# EAGLE design out8_16A_mi (EAGLE 5.04)
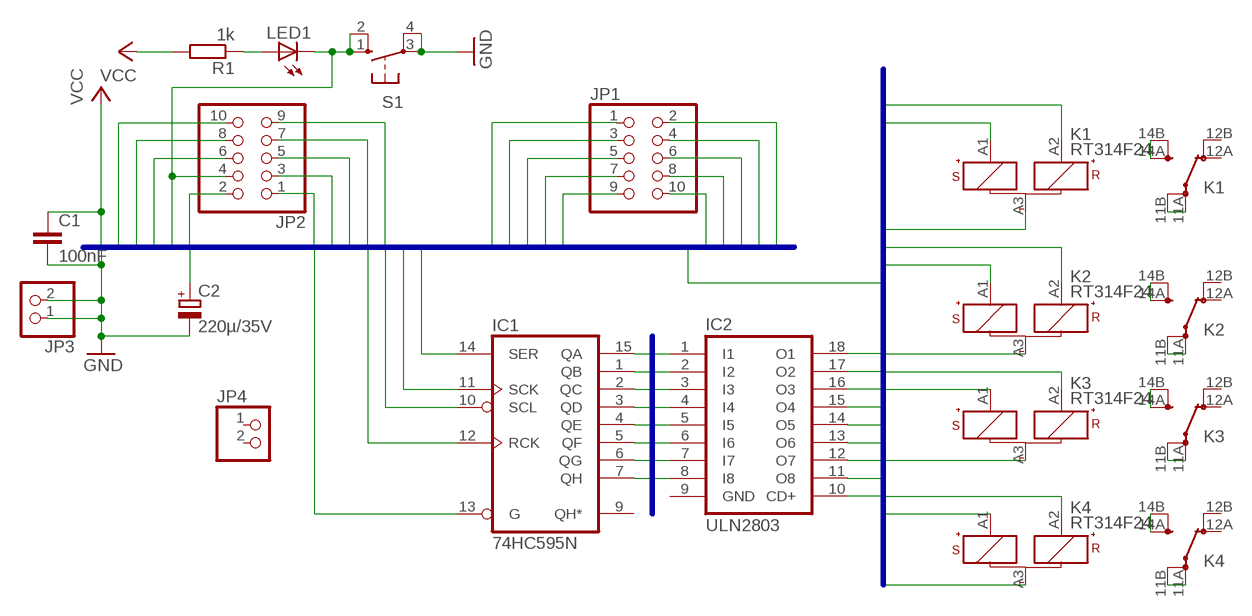
[diagram p0: schematic, sheet 1]

## Parts
C1  100nF  C-EU050-024X044  [C050-024X044]
C2  220µ/35V  CPOL-EUE5-10.5  [E5-10,5]
IC1  74HC595N  [DIL16]
IC2  ULN2803  ULN2803A  [DIL18]
JP1  PINHD-2X5  [2X05]
JP2  PINHD-2X5  [2X05]
JP3  PINHD-1X2  [1X02]
JP4  PINHD-1X2  [1X02]
K1  RT314F24  [RT1-BI]
K2  RT314F24  [RT1-BI]
K3  RT314F24  [RT1-BI]
K4  RT314F24  [RT1-BI]
LED1  LED3MM  [LED3MM]
R1  1k  R-EU_0207/2V  [0207/2V]
S1  10-XX  [B3F-10XX]

## Nets
CTRL: IC1.13(G) JP1.3 JP2.3
EIB+: JP1.1 JP2.1
GND: C1.2 C2.- JP1.2 JP2.2 JP3.1 JP3.2 S1.3(P) S1.4(P1)
IO0: JP1.7 JP2.7
IO1: IC1.14(SER) JP1.8 JP2.8
IO2: IC1.12(RCK) JP1.9 JP2.9
IO3: IC1.11(SCK) JP1.10 JP2.10
N$1: K1.14A(2:SA) K1.14B(2:SB)
N$2: K1.11A(2:PA) K1.11B(2:PB)
N$11: K2.14A(2:SA) K2.14B(2:SB)
N$12: K2.11A(2:PA) K2.11B(2:PB)
N$18: K3.14A(2:SA) K3.14B(2:SB)
N$19: K3.11A(2:PA) K3.11B(2:PB)
N$20: K4.14A(2:SA) K4.14B(2:SB)
N$21: K4.11A(2:PA) K4.11B(2:PB)
N$30: LED1.A R1.1
O1: IC2.18(O1) K2.A1(1:S+)
O2: IC2.17(O2) K2.A2(1:R+)
O3: IC2.16(O3) K1.A1(1:S+)
O4: IC2.15(O4) K1.A2(1:R+)
O5: IC2.14(O5) K4.A1(1:S+)
O6: IC2.13(O6) K4.A2(1:R+)
O7: IC2.12(O7) K3.A1(1:S+)
O8: IC2.11(O8) K3.A2(1:R+)
PARSEROUT0: IC1.7(QH) IC2.1(I1)
PARSEROUT1: IC1.6(QG) IC2.2(I2)
PARSEROUT2: IC1.5(QF) IC2.3(I3)
PARSEROUT3: IC1.4(QE) IC2.4(I4)
PARSEROUT4: IC1.3(QD) IC2.5(I5)
PARSEROUT5: IC1.2(QC) IC2.6(I6)
PARSEROUT6: IC1.1(QB) IC2.7(I7)
PARSEROUT7: IC1.15(QA) IC2.8(I8)
PROG: JP1.4 JP2.4 LED1.K(C) S1.1(S) S1.2(S1)
VCC: C1.1 IC1.10(SCL) JP1.5 JP2.5 R1.2
VERS: C2.+ IC2.10(CD+) JP1.6 JP2.6 K1.A3(1:-) K2.A3(1:-) K3.A3(1:-) K4.A3(1:-)
Unconnected: IC1.9(QH*) JP4.1 JP4.2 K1.12A(2:OA) K1.12B(2:OB) K2.12A(2:OA) K2.12B(2:OB) K3.12A(2:OA) K3.12B(2:OB) K4.12A(2:OA) K4.12B(2:OB)

## Buses
EIB+,GND,CTRL,PROG,VCC,VERS,IO[0..3]
PARSEROUT[0..7]
O[1..8],VERS

## Power pins joined to a net without a drawn wire
GND: IC1.8(GND) IC2.9(GND)
VCC: IC1.16(VCC)

## Library data of the parts
C1 = rcl:C-EU: CAPACITOR, European symbol
C2 = rcl:CPOL-EU: POLARIZED CAPACITOR, European symbol
IC1 = 74xx-eu:74*595: 8-bit SHIFT REGISTER, output latch
IC2 = uln-udn:ULN2803A: DRIVER ARRAY
JP1 JP2 = pinhead:PINHD-2X5: PIN HEADER
JP3 JP4 = pinhead:PINHD-1X2: PIN HEADER
K1-K4 = relay:RT?F*: Power PCB Relay SCHRACK bistable 1 pole 16 A, polarized bistable version Source: http://www.schrack.com/.. 5821.pdf
LED1 = led:LED: LED OSRAM: - CHIPLED LG R971, LG N971, LY N971, LG Q971, LY Q971, LO R971, LY R971 LH N974, LH R974 LS Q976, LO Q976, LY Q976 LO Q996 - Hyper CHIPLED LW Q18S LB Q993, LB Q99A, LB R99A - SideLED LS A670, LO A670, LY A670, LG A670, LP A670 LB A673, LV A673, LT A673, LW A673 LH A674 LY A675 LS A676, LA A676, LO A676, LY A676, LW A676 LS A679, LY A679, LG A679 - Hyper Micro SIDELED® LS Y876, LA Y876, LO Y876, LY Y876 LT Y87S - SmartLED LW L88C, LW L88S LB L89C, LB L89S, LG L890 LS L89K, LO L89K, LY L89K LS L896, LA L896, LO L896, LY L896 - TOPLED LS T670, LO T670, LY T670, LG T670, LP T670 LSG T670, LSP T670, LSY T670, LOP T670, LYG T670 LG T671, LOG T671, LSG T671 LB T673, LV T673, LT T673, LW T673 LH T674 LS T676, LA T676, LO T676, LY T676, LB T676, LH T676, LSB T676, LW T676 LB T67C, LV T67C, LT T67C, LS T67K, LO T67K, LY T67K, LW E67C LS E67B, LA E67B, LO E67B, LY E67B, LB E67C, LV E67C, LT E67C LW T67C LS T679, LY T679, LG T679 LS T770, LO T770, LY T770, LG T770, LP T770 LB T773, LV T773, LT T773, LW T773 LH T774 LS E675, LA E675, LY E675, LS T675 LS T776, LA T776, LO T776, LY T776, LB T776 LHGB T686 LT T68C, LB T68C - Hyper Mini TOPLED® LB M676 - Mini TOPLED Santana® LG M470 LS M47K, LO M47K, LY M47K Source: http://www.osram.convergy.de - LUMILED® LXK2-PW12-R00, LXK2-PW12-S00, LXK2-PW14-U00, LXK2-PW14-V00 LXK2-PM12-R00, LXK2-PM12-S00, LXK2-PM14-U00 LXK2-PE12-Q00, LXK2-PE12-R00, LXK2-PE12-S00, LXK2-PE14-T00, LXK2-PE14-U00 LXK2-PB12-K00, LXK2-PB12-L00, LXK2-PB12-M00, LXK2-PB14-N00, LXK2-PB14-P00, LXK2-PB14-Q00 LXK2-PR12-L00, LXK2-PR12-M00, LXK2-PR14-Q00, LXK2-PR14-R00 LXK2-PD12-Q00, LXK2-PD12-R00, LXK2-PD12-S00 LXK2-PH12-R00, LXK2-PH12-S00 LXK2-PL12-P00, LXK2-PL12-Q00, LXK2-PL12-R00 Source: www.luxeon.com
R1 = rcl:R-EU_: RESISTOR, European symbol
S1 = switch-omron:10-XX: OMRON SWITCH

## Board
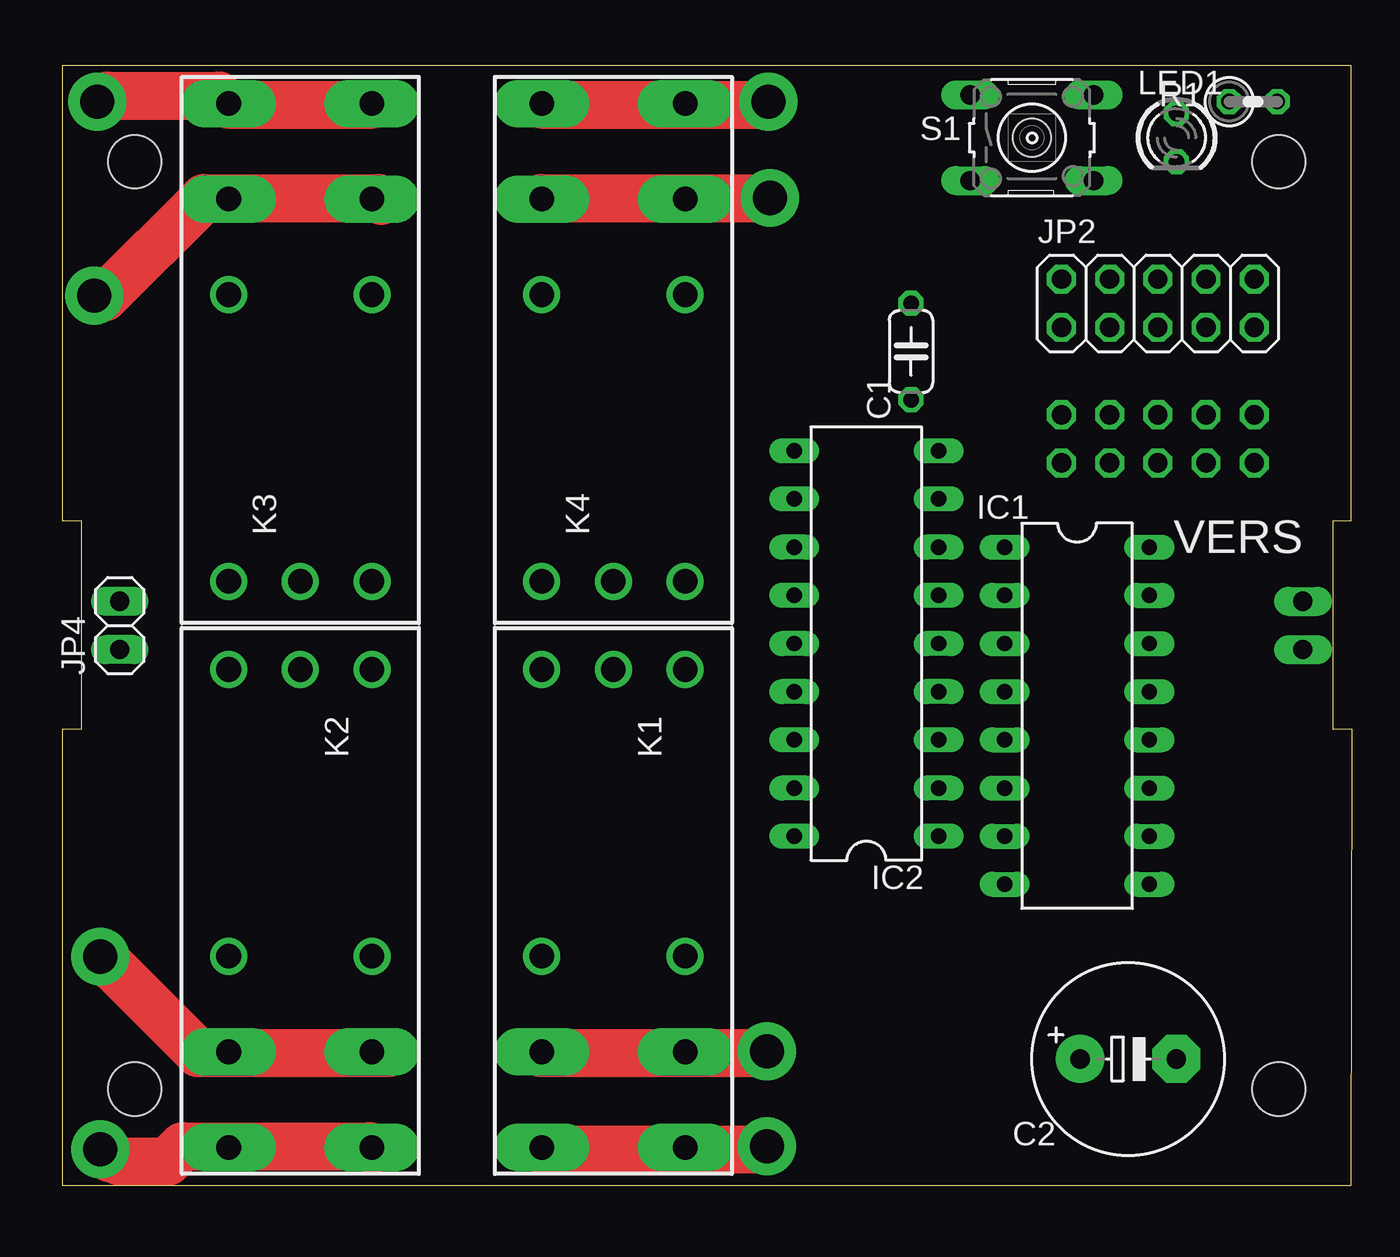
[diagram p1: board, top side]
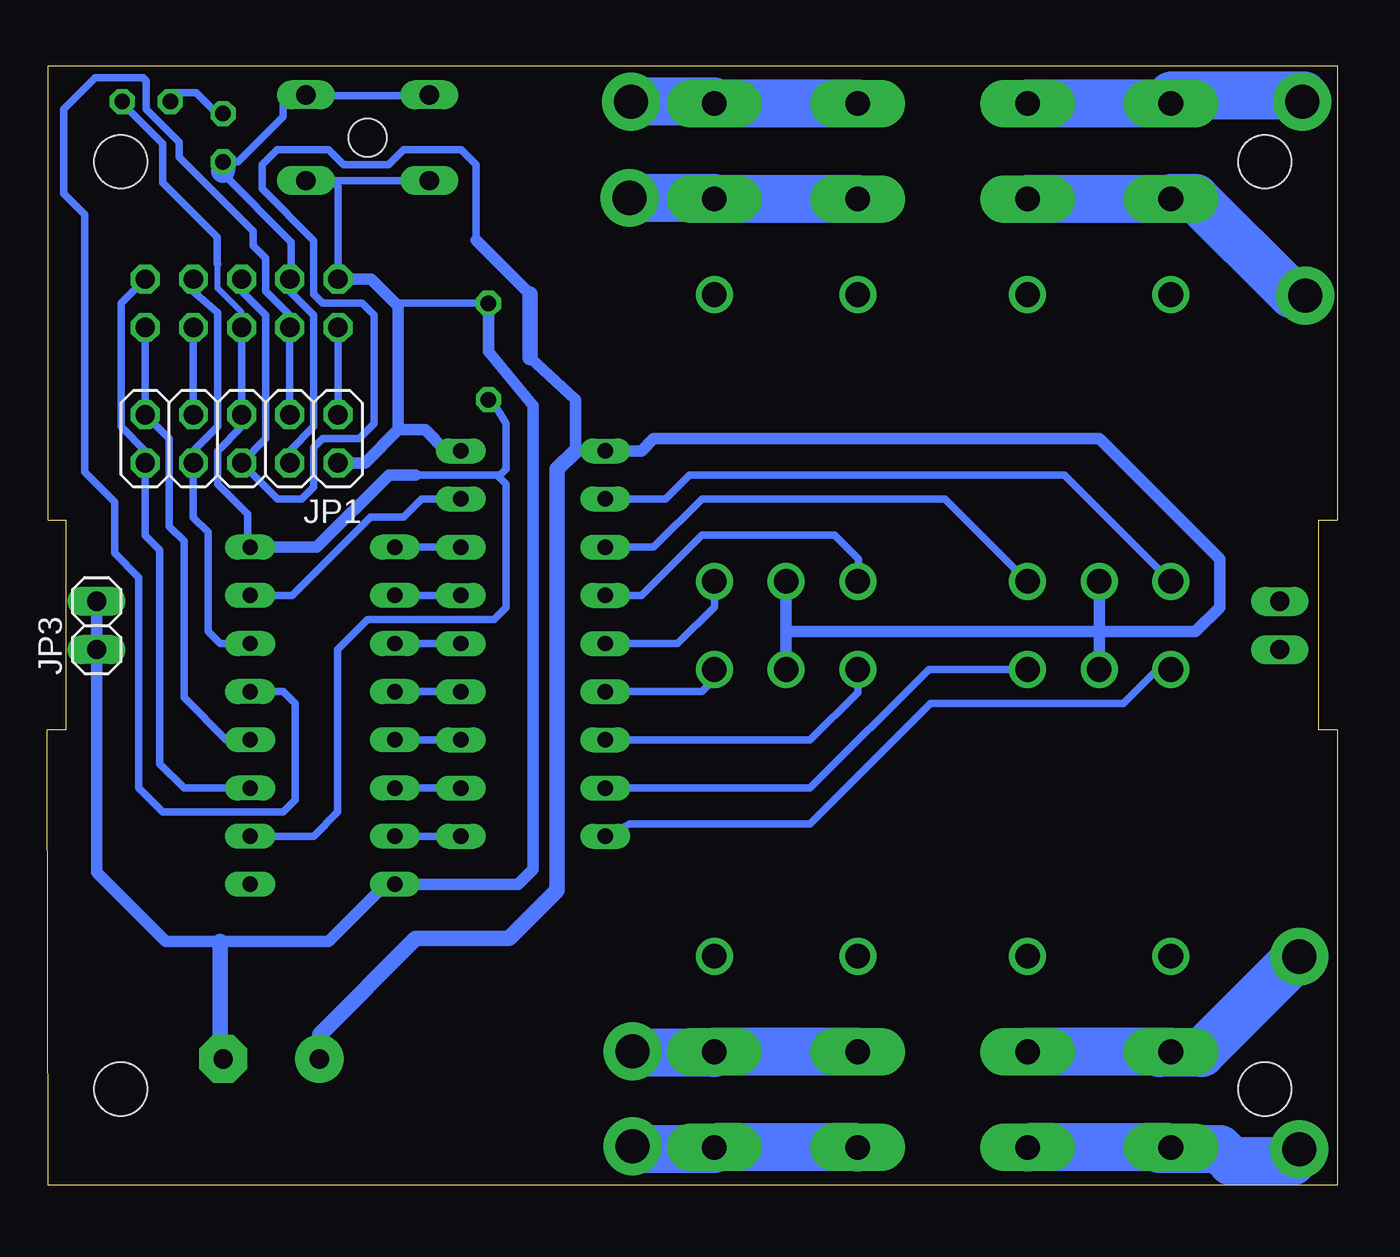
[diagram p2: board, bottom side, seen from below]

Size 68 x 59.05 mm. Coordinates in mm from the lower left corner, seen from the top.
Outline: 0,59.05 0,35.05 1,35.05 1,24.05 0,24.05 0,0 67.95,0 68,23.55 68,24.05 67,24.05 67,35.05 67.95,35.05 67.95,59.05 0,59.05
Copper layers (1*16): Top 0.035mm / dielectric 1.5mm / Bottom 0.035mm
Design rules "default": minimum track width 10mil, minimum drill 24mil, track to track 8mil, track to pad 8mil, pad to pad 8mil, via to via 8mil, smd to smd 8mil, copper to edge 40mil, drill to drill 8mil, minimum pad ring 10mil, minimum via ring 8mil, stop-mask expansion 4mil, vias tented up to drill 0mil, thermal gap 10mil
Holes 2.8 mm at 3.81,5.08 64.14,5.08 64.14,53.98 3.81,53.98
Holes 2 mm at 51.12,55.24
tKeepout: area 1.8,3 to 5.9,7.1; area 62.1,3.1 to 66.1,7.1; area 1.8,52 to 5.8,56; area 62.1,52 to 66.1,56
bKeepout: area 1.8,3.1 to 5.8,7.1; area 1.8,52 to 5.8,56; area 62.1,3.1 to 66.1,7.1; area 62.1,52 to 66.1,56; area 37.8,46.6 to 42.8,51.6

### Footprints (pad centres in the part's own frame; a part is rotated, then mirrored left to right if it is on the bottom)
C050-024X044 = drill 0.813 octagon: 1 -2.54,0; 2 2.54,0
E5-10,5 = drill 1.016 pad 2.54 round: + -2.54,0 | drill 1.016 pad 2.54 octagon: - 2.54,0
DIL16 = drill 0.813 long: 1 -8.89,-3.81; 2 -6.35,-3.81; 3 -3.81,-3.81; 4 -1.27,-3.81; 5 1.27,-3.81; 6 3.81,-3.81; 7 6.35,-3.81; 8 8.89,-3.81; 9 8.89,3.81; 10 6.35,3.81; 11 3.81,3.81; 12 1.27,3.81; 13 -1.27,3.81; 14 -3.81,3.81; 15 -6.35,3.81; 16 -8.89,3.81
DIL18 = drill 0.813 long: 1 -10.16,-3.81; 2 -7.62,-3.81; 3 -5.08,-3.81; 4 -2.54,-3.81; 5 0,-3.81; 6 2.54,-3.81; 7 5.08,-3.81; 8 7.62,-3.81; 9 10.16,-3.81; 10 10.16,3.81; 11 7.62,3.81; 12 5.08,3.81; 13 2.54,3.81; 14 0,3.81; 15 -2.54,3.81; 16 -5.08,3.81; 17 -7.62,3.81; 18 -10.16,3.81
2X05 = drill 1.016 octagon: 1 -5.08,-1.27; 2 -5.08,1.27; 3 -2.54,-1.27; 4 -2.54,1.27; 5 0,-1.27; 6 0,1.27; 7 2.54,-1.27; 8 2.54,1.27; 9 5.08,-1.27; 10 5.08,1.27
1X02 = drill 1.016 long: 1 -1.27,0; 2 1.27,0
RT1-BI = drill 1.3 pad 2.5 long: 11A 7.56,3.78; 11B 7.56,-3.78; 14A 12.6,3.78; 14B 12.6,-3.78 | drill 1.3 round: 12A 2.52,3.78; 12B 2.52,-3.78; A1 -12.6,-3.78; A2 -12.6,3.78; A3 -12.6,0
LED3MM = drill 0.813 octagon: A -1.27,0; K 1.27,0
0207/2V = drill 0.813 octagon: 1 -1.27,0; 2 1.27,0
B3F-10XX = drill 1.016 long: 1 -3.251,2.261; 2 3.251,2.261; 3 -3.251,-2.261; 4 3.251,-2.261

### Placement (x,y rotation side)
C1  44.74,43.97 90 top
C2  56.2,6.67 0 top
IC1  53.5,24.77 270 top
IC2  42.39,28.58 90 top
JP1  57.76,39.37 180 bottom
JP2  57.76,46.51 0 top
JP3  65.41,29.53 90 bottom
JP4  3.02,29.53 90 top
K1  29.05,14.61 270 top
K2  12.54,14.61 270 top
K3  12.54,44.45 90 top
K4  29.05,44.45 90 top
LED1  58.74,55.24 270 top
R1  62.79,57.15 0 top
S1  51.12,55.24 0 top

### Tracks (layer width: path | path; a pad name or v marks a point on that pad's centre or on a via)
CTRL
  Bottom 0.406: JP1.3 JP2.3 55.22,45.88 56.49,47.15 56.49,48.89 57.15,49.55 57.15,50.32 61.04,54.21 61.04,55.01 62.79,56.75 62.79,58.26 62.94,58.42 65.48,58.42 67.15,56.75 67.15,52.31 66.04,51.2 66.04,37.62 64.45,36.04 64.45,33.34 63.18,32.07 63.18,20.95 61.91,19.68 55.56,19.68 54.93,20.32 54.93,25.4 55.56,26.03 IC1.13
EIB+
  Bottom 0.406: JP1.1 JP2.1
GND
  Bottom 0.406: 53,52.98 S1.3 | 53,52.98 S1.4 | JP2.2 52.68,52.67 53,52.98 | C1.2 49.35,46.51 49.51,46.35
  Bottom 0.61: IC1.8 43.18,15.87 42.39,16.67 42.39,41.12 44.74,43.97 C1.2 | IC1.8 | JP1.2 51.25,38.1 49.51,39.85 | IC1.8 50.16,15.87 53.18,12.86 58.9,12.86 61.75,12.86 65.4,16.51 JP3.1 JP3.2 | 49.51,39.85 49.51,46.35 50.93,47.78 JP2.2 | IC2.9 46.97,38.73 48.08,39.85 49.51,39.85
  Bottom 0.813: C2.- 58.9,6.67 58.9,12.86
IO0
  Bottom 0.406: JP1.7 JP2.7
IO1
  Bottom 0.406: JP2.8 60.3,47.14 60.18,47.02 59.03,46.01 59.03,40 60.3,38.73 JP1.8 60.3,35.22 59.53,34.45 59.53,29.21 58.9,28.57 IC1.14 | IC1.14
IO2
  Bottom 0.406: JP2.9 JP1.9 61.57,39.37 61.57,34.74 60.8,33.97 60.8,25.72 58.58,23.49 IC1.12 | IC1.12
IO3
  Bottom 0.406: JP2.10 64.11,46.51 64.11,40 62.84,38.73 JP1.10 62.84,34.27 62.07,33.5 62.07,22.22 60.8,20.95 IC1.11
N$1
  Bottom 2.54: K1.14B K1.14A
N$2
  Bottom 2.54: K1.11B K1.11A
N$3  (via drill 1.8 pad 3.05)
  other vias: 1.98,1.91
N$4  (via drill 1.8 pad 3.05)
  other vias: 1.98,12.06
N$5  (via drill 1.8 pad 3.05)
  other vias: 1.67,46.91
N$6  (via drill 1.8 pad 3.05)
  other vias: 1.83,57.15
N$7  (via drill 1.8 pad 3.05)
  other vias: 37.23,57.15
N$8  (via drill 1.8 pad 3.05)
  Bottom 2.54: 32.86,52.07 v37.31,52.07
N$9  (via drill 1.8 pad 3.05)
  other vias: 37.15,7.06
N$10  (via drill 1.8 pad 3.05)
  other vias: 37.15,2.06
N$11
  Bottom 2.54: K2.14B K2.14A
N$12
  Bottom 2.54: K2.11B K2.11A
N$18
  Bottom 2.54: K3.14A K3.14B
N$19
  Bottom 2.54: K3.11A K3.11B
N$20
  Bottom 2.54: K4.14A K4.14B
N$21
  Bottom 2.54: K4.11A K4.11B
N$22
  Bottom 2.54: 32.86,6.98 37.31,6.98
N$23
  Bottom 2.54: 32.86,1.9 37.31,1.9
N$24
  Bottom 2.54: 1.75,1.9 2.38,1.27 5.56,1.27 6.19,1.9 9.37,1.9
N$25
  Bottom 2.54: 2.06,12.06 7.14,6.98 9.37,6.98
N$26
  Bottom 2.54: 1.75,46.99 2.38,46.99 7.46,52.07 8.73,52.07
N$27
  Bottom 2.54: 1.75,57.47 8.73,57.47
N$28
  Bottom 2.54: 32.86,57.15 37.31,57.15
N$29
  Top 2.54: 1.75,57.15 2.06,57.15 2.38,57.47 8.25,57.47 8.73,56.99 16.35,56.99
N$30
  Bottom 0.406: LED1.A 59.06,56.51 60.17,57.63 61.36,57.63 R1.1
N$31
  Top 2.54: 25.24,56.99 37.15,56.99 37.31,57.15
N$32
  Top 2.54: 25.24,52.07 37.46,52.07
N$33
  Top 2.54: 1.75,46.83 2.22,46.83 7.46,52.07 16.67,52.07 16.83,51.91
N$34
  Top 2.54: 2.06,1.9 | 2.06,1.9 2.54,1.43 2.86,1.43 3.02,1.27 5.56,1.27 6.35,2.06 16.19,2.06 16.35,1.9
N$35
  Top 2.54: 2.06,12.22 2.06,12.06 7.14,6.98 17.14,6.98
N$36
  Top 2.54: 25.24,6.98 36.99,6.98 37.15,7.14
N$37
  Top 2.54: 25.24,1.9 37.15,1.9
O1
  Bottom 0.406: K2.A1 9.47,27.2 11.27,25.4 21.43,25.4 27.78,19.05 37.31,19.05 IC2.18
O2
  Bottom 0.406: K2.A2 21.53,27.2 27.78,20.95 IC2.17
O3
  Bottom 0.406: K1.A1 25.27,26 27.78,23.49 IC2.16
O4
  Bottom 0.406: K1.A2 32.83,26.7 33.5,26.03 IC2.15
O5
  Bottom 0.406: K4.A1 32.83,30.51 34.77,28.57 IC2.14
O6
  Bottom 0.406: IC2.13 36.67,31.11 33.5,34.29 26.51,34.29 25.24,33.02 25.24,31.88 K4.A2
O7
  Bottom 0.406: IC2.12 36.04,33.65 33.5,36.19 20.67,36.19 K3.A1
O8
  Bottom 0.406: IC2.11 35.4,36.19 34.13,37.46 14.38,37.46 K3.A2
PARSEROUT0
  Bottom 0.406: IC2.1 IC1.7 | IC1.7
PARSEROUT1
  Bottom 0.406: IC1.6 48.42,20.95 46.99,20.95 IC2.2
PARSEROUT2
  Bottom 0.406: IC1.5 48.42,23.49 46.99,23.49 IC2.3
PARSEROUT3
  Bottom 0.406: IC2.4 IC1.4 | IC1.4
PARSEROUT4
  Bottom 0.406: IC1.3 48.42,28.57 46.99,28.57 IC2.5
PARSEROUT5
  Bottom 0.406: IC1.2 48.42,31.11 46.99,31.11 IC2.6
PARSEROUT6
  Bottom 0.406: IC1.1 48.42,33.65 46.99,33.65 IC2.7
PARSEROUT7
  Bottom 0.406: IC2.8 48.26,36.19 49.21,35.24 50.96,35.24 51.91,34.29 55.09,31.11 IC1.15 | IC1.15
PROG
  Bottom 0.406: JP1.4 55.22,38.73 53.95,40 53.95,45.88 55.22,47.15 JP2.4 55.14,47.87 55.14,49.74 58.74,53.34 58.74,53.9 58.7,53.94 LED1.K 57.94,53.97 55.56,56.36 55.56,57.43 S1.2 54.01,57.51 53.97,57.47 49.17,57.47 S1.1
  Bottom 1.27: LED1.K 58.74,53.5
VCC
  Bottom 0.305: JP2.5 57.76,46.04 59.03,47.31 59.03,48.58
  Bottom 0.406: JP2.5 JP1.5 57.76,40 59.03,38.73 59.03,36.99 57.44,35.4 57.44,33.65 IC1.16 | 44.21,37.39 43.82,36.99 43.82,30.48 44.45,29.84 51.12,29.84 52.71,28.26 52.71,19.68 53.97,18.41 IC1.10 | 44.21,37.39 44.29,37.46 48.58,37.46 | C1.1 44.59,41.43 43.82,40.16 43.82,37.78 44.21,37.39 | R1.2 64.06,57.07 61.91,54.93 61.91,52.86 59.06,50.01 59.06,48.6 59.03,48.58
  Bottom 0.61: IC1.16 53.79,33.65 49.98,37.46 48.58,37.46 | IC1.16 | IC1.10
VERS
  Bottom 0.406: JP2.6 57.76,47.15 56.49,45.88 56.49,39.37 JP1.6 55.86,36.19 54.59,36.19 53.95,36.83 53.95,38.89 53.47,39.37 51.57,39.37 50.78,40.16 50.78,45.88 51.41,46.51 53.47,46.51 53.95,46.99 53.95,49.82 56.67,52.55 56.67,53.82 55.88,54.61 53.18,54.61 52.39,53.82 50.01,53.82 49.21,54.61 46.2,54.61 45.4,53.82 45.4,49.85
  Bottom 0.61: 29.05,29.21 K4.A3 | 29.05,29.21 K1.A3 | 12.54,29.21 K3.A3 | 12.54,29.21 29.05,29.21 | 12.54,29.21 K2.A3 | 12.54,29.21 7.46,29.21 6.19,30.48 6.19,33.02 12.54,39.37 36.04,39.37 36.67,38.73 IC2.10 40.16,38.73 40.16,41.43 42.54,43.66 | 42.54,46.99 45.4,49.85
  Bottom 0.813: C2.+ 53.66,7.94 48.58,13.02 43.66,13.02 41.12,15.56 41.12,37.78 40.16,38.73 | 42.54,43.66 42.54,46.99

### Text on the board
tPlace: VERS